# EAGLE design Robot (EAGLE 6.5.0)
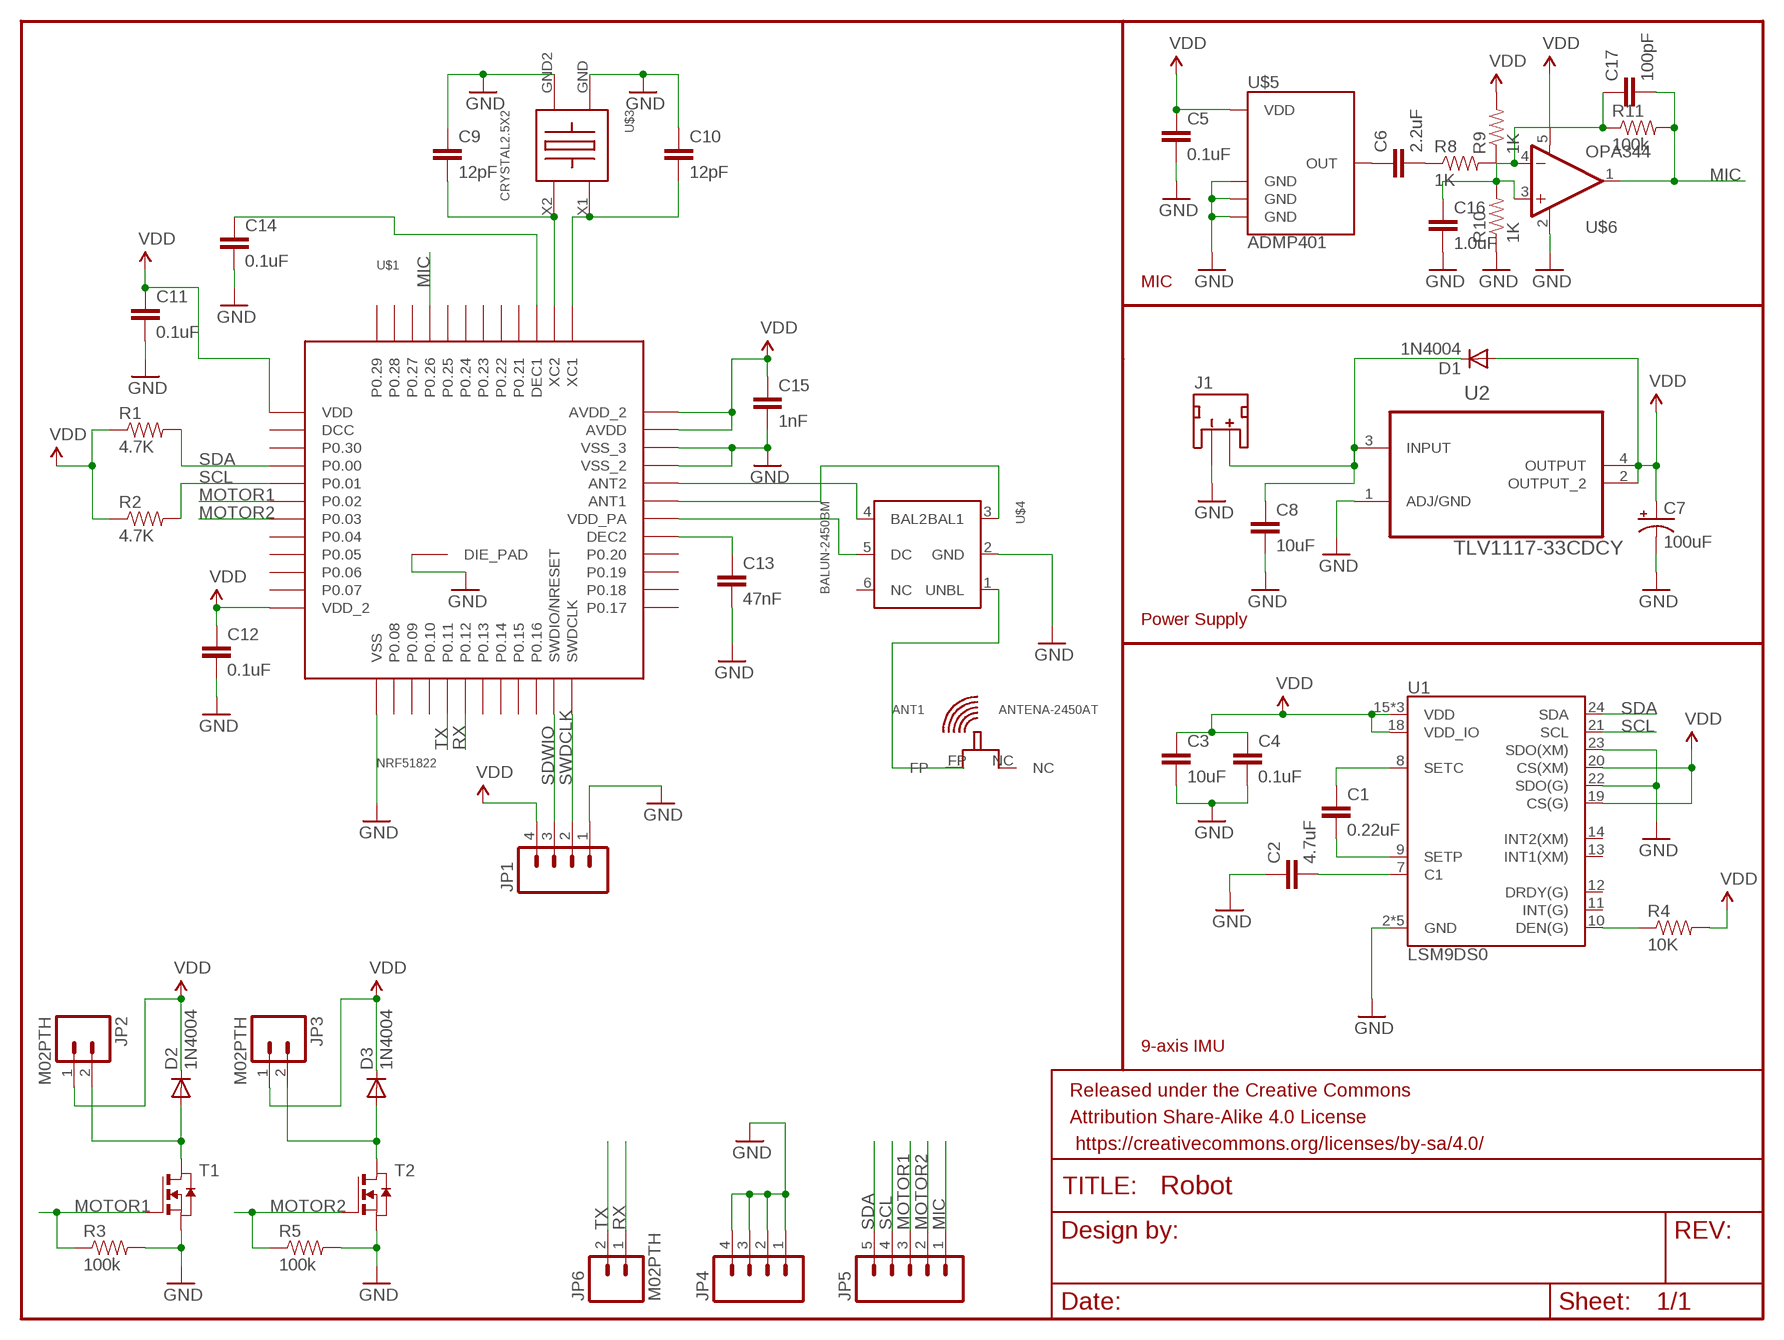
[diagram p0: schematic, sheet 1]

## Parts
ANT1  ANTENA-2450AT  [2450AT18B100]
C1  0.22uF  0.22UF-25V-10%(0603)  [0603-CAP]
C2  4.7uF  4.7UF-6.3V-10%(0603)0603  [0603-CAP]
C3  10uF  10UF-6.3V-20%(0603)  [0603-CAP]
C4  0.1uF  0.1UF-100V-10%(0603)  [0603-CAP]
C5  0.1uF  0.1UF-100V-10%(0603)  [0603-CAP]
C6  2.2uF  2.2UF-10V-20%(0603)  [0603-CAP]
C7  100uF  100UF-10V-10%(TANT)  [EIA7343]
C8  10uF  10UF-6.3V-20%(0603)  [0603-CAP]
C9  12pF  12PF-50V-5%(0603)  [0603-CAP]
C10  12pF  12PF-50V-5%(0603)  [0603-CAP]
C11  0.1uF  0.1UF-100V-10%(0603)  [0603-CAP]
C12  0.1uF  0.1UF-100V-10%(0603)  [0603-CAP]
C13  47nF  47NF(0.047UF/47000PF)-25V-5%(0603)SMD  [0603-CAP]
C14  0.1uF  0.1UF-100V-10%(0603)  [0603-CAP]
C15  1nF  1NF/1000PF-50V-10%(0603)  [0603-CAP]
C16  1.0uF  1.0UF-16V-10%(0603)  [0603-CAP]
C17  100pF  100PF-50V-5%(0603)  [0603-CAP]
D1  1N4004  [DO41-10]
D2  1N4004  [DO41-10]
D3  1N4004  [DO41-10]
FRAME1  FRAME-LETTER  [CREATIVE_COMMONS]
J1  JST_2MM_MALE  [JST-2-SMD]
JP1  M04PTH  [1X04]
JP2  M02PTH  [1X02]
JP3  M02PTH  [1X02]
JP4  M04PTH  [1X04]
JP5  M05PTH  [1X05]
JP6  M02PTH  [1X02]
R1  4.7K  4.7KOHM-1/10W-1%(0603)  [0603-RES]
R2  4.7K  4.7KOHM-1/10W-1%(0603)  [0603-RES]
R3  100k  100KOHM-1/10W-1%(0603)  [0603-RES]
R4  10K  10KOHM-1/10W-1%(0603)0603  [0603-RES]
R5  100k  100KOHM-1/10W-1%(0603)  [0603-RES]
R8  1K  1KOHM-1/10W-1%(0603)  [0603-RES]
R9  1K  1KOHM-1/10W-1%(0603)  [0603-RES]
R10  1K  1KOHM-1/10W-1%(0603)  [0603-RES]
R11  100k  100KOHM-1/10W-1%(0603)  [0603-RES]
T1  NMOSSOT23  [SOT-23]
T2  NMOSSOT23  [SOT-23]
U1  LSM9DS0  [LGA-24]
U2  TLV1117-33CDCY  [SOT230P700X180-4N]
U$1  NRF51822  [QFN48]
U$3  CRYSTAL2.5X2  [2.5X2MM]
U$4  BALUN-2450BM  [2450BM14A0002]
U$5  ADMP401  [ADMP401]
U$6  OPA344  [SOT23-5]

## Nets
GND: C2.1 C3.2 C4.2 C5.2 C7.C(-) C8.2 C9.1 C10.1 C11.2 C12.2 C13.2 C14.2 C15.2 C16.2 J1.1(-) JP1.1 JP4.1 JP4.2 JP4.3 JP4.4 R3.2 R5.2 R10.1 T1.2(S) T2.2(S) U1.2(GND) U1.3(GND) U1.4(GND) U1.5(GND) U1.6(GND) U1.22(SDO(G)) U1.23(SDO(XM)) U2.1(ADJ/GND) U$1.13(VSS) U$1.33(VSS_2) U$1.34(VSS_3) U$1.GND(DIE_PAD) U$3.GND U$3.GND2 U$4.2(GND) U$5.2(GND) U$5.4(GND) U$5.6(GND) U$6.2(V-)
MIC: C17.2 JP5.1 R11.2 U$1.45(P0.26) U$6.1(OUT)
MOTOR1: JP5.3 R3.1 T1.3(G) U$1.6(P0.02)
MOTOR2: JP5.2 R5.1 T2.3(G) U$1.7(P0.03)
N$1: C1.1 U1.8(SETC)
N$2: C1.2 U1.9(SETP)
N$3: C2.2 U1.7(C1)
N$4: R4.1 U1.10(DEN(G))
N$5: C8.1 D1.C J1.2(+) U2.3(INPUT)
N$6: C6.1 U$5.1(OUT)
N$7: C13.1 U$1.29(DEC2)
N$8: C9.2 U$1.38(XC2) U$3.X2
N$9: C10.2 U$1.37(XC1) U$3.X1
N$10: C14.1 U$1.39(DEC1)
N$11: U$1.32(ANT2) U$4.4(BAL2)
N$12: U$1.31(ANT1) U$4.3(BAL1)
N$13: U$1.30(VDD_PA) U$4.5(DC)
N$14: ANT1.FP U$4.1(UNBL)
N$15: D2.A JP2.2 T1.1(D)
N$16: D3.A JP3.2 T2.1(D)
N$19: C6.2 R8.1
N$20: C16.1 R9.1 R10.2 U$6.3(+IN)
N$22: C17.1 R8.2 R11.1 U$6.4(-IN)
RX: JP6.1 U$1.18(P0.12)
SCL: JP5.4 R2.2 U1.21(SCL) U$1.5(P0.01)
SDA: JP5.5 R1.2 U1.24(SDA) U$1.4(P0.00)
SDWIO: JP1.3 U$1.23(SWDIO/NRESET)
SWDCLK: JP1.2 U$1.24(SWDCLK)
TX: JP6.2 U$1.17(P0.11)
VDD: C3.1 C4.1 C5.1 C7.A(+) C11.1 C12.1 C15.1 D1.A D2.C D3.C JP1.4 JP2.1 JP3.1 R1.1 R2.1 R4.2 R9.2 U1.15(VDD) U1.16(VDD) U1.17(VDD) U1.18(VDD_IO) U1.19(CS(G)) U1.20(CS(XM)) U2.2(OUTPUT_2) U2.4(OUTPUT) U$1.1(VDD) U$1.12(VDD_2) U$1.35(AVDD) U$1.36(AVDD_2) U$5.5(VDD) U$6.5(V+)
Unconnected: ANT1.NC J1.NC1(PAD1) J1.NC2(PAD2) U1.11(INT(G)) U1.12(DRDY(G)) U1.13(INT1(XM)) U1.14(INT2(XM)) U$1.2(DCC) U$1.3(P0.30) U$1.8(P0.04) U$1.9(P0.05) U$1.10(P0.06) U$1.11(P0.07) U$1.14(P0.08) U$1.15(P0.09) U$1.16(P0.10) U$1.19(P0.13) U$1.20(P0.14) U$1.21(P0.15) U$1.22(P0.16) U$1.25(P0.17) U$1.26(P0.18) U$1.27(P0.19) U$1.28(P0.20) U$1.40(P0.21) U$1.41(P0.22) U$1.42(P0.23) U$1.43(P0.24) U$1.44(P0.25) U$1.46(P0.27) U$1.47(P0.28) U$1.48(P0.29) U$4.6(NC)

## Notes on the sheet
- MIC
- Power Supply
- 9-axis IMU

## Library data of the parts
ANT1 = NordicSemi:ANTENA-2450AT: General Specifications: Part Number 2450AT18B100 Input Power 3W max. Frequency Range 2400 - 2500 Mhz Impedance 50 Ω Peak Gain 0.5 dBi typ. (XZ-V) Operating Temperature -40 to +85°C Average Gain -0.5 dBi typ. (XZ-V) Reel Quanity 3,000 Return Loss 9.5 dB min
C1 = SparkFun-Capacitors:0.22UF-25V-10%(0603): CAP-07822; PROD_ID: CAP-07822
C2 = SparkFun-Capacitors:4.7UF-6.3V-10%(0603): CAP-08280; PROD_ID: CAP-08280
C3 C8 = SparkFun-Capacitors:10UF-6.3V-20%(0603): CAP-11015; PROD_ID: CAP-11015
C4 C5 C11 C12 C14 = SparkFun-Capacitors:0.1UF-100V-10%(0603): CAP-08390; PROD_ID: CAP-08390
C6 = SparkFun-Capacitors:2.2UF-10V-20%(0603): CAP-07888; PROD_ID: CAP-07888
C7 = SparkFun-Capacitors:100UF-10V-10%(TANT): CAP-07890; PROD_ID: CAP-07890
C9 C10 = SparkFun-Capacitors:12PF-50V-5%(0603): CAP-09137; PROD_ID: CAP-09137
C13 = SparkFun-Capacitors:47NF(0.047UF/47000PF)-25V-5%(0603): CAP-08605; PROD_ID: CAP-08605
C15 = SparkFun-Capacitors:1NF/1000PF-50V-10%(0603): CAP-07886; PROD_ID: CAP-07886
C16 = SparkFun-Capacitors:1.0UF-16V-10%(0603): CAP-00868; PROD_ID: CAP-00868
C17 = SparkFun-Capacitors:100PF-50V-5%(0603): CAP-07883; PROD_ID: CAP-07883
D1-D3 = diode:1N4004: DIODE general purpose rectifier, 1 A
FRAME1 = SparkFun-Aesthetics:FRAME-LETTER: Schematic Frame Standard 8.5x11 US Letter frame
J1 = SparkFun-Connectors:JST_2MM_MALE: Mates to single-cell LiPo batteries. CONN-08352; PROD_ID: CONN-08352
JP1 JP4 = SparkFun-Connectors:M04: Header 4 Standard 4-pin 0.1" header. Use with straight break away headers (SKU : PRT-00116), right angle break away headers (PRT-00553), swiss pins (PRT-00743), machine pins (PRT-00117), and female headers (PRT-00115). Molex polarized connector foot print use with SKU : PRT-08231 with associated crimp pins and housings. 1MM SMD Version SKU: PRT-10208
JP2 JP3 JP6 = SparkFun-Connectors:M02: Standard 2-pin 0.1" header. Use with - straight break away headers ( PRT-00116) - right angle break away headers (PRT-00553) - swiss pins (PRT-00743) - machine pins (PRT-00117) - female headers (PRT-00115) Molex polarized connector foot print use with: PRT-08233 with associated crimp pins and housings. 2.54_SCREWTERM for use with PRT-10571. 3.5mm Screw Terminal footprints for PRT-08084 5mm Screw Terminal footprints for use with PRT-08432
JP5 = SparkFun-Connectors:M05: Header 5 Standard 5-pin 0.1" header. Use with straight break away headers (SKU : PRT-00116), right angle break away headers (PRT-00553), swiss pins (PRT-00743), machine pins (PRT-00117), and female headers (PRT-00115). Molex polarized connector foot print use with SKU : PRT-08230 with associated crimp pins and housings.
R1 R2 = SparkFun-Resistors:4.7KOHM-1/10W-1%(0603): RES-07857; PROD_ID: RES-07857
R3 R5 R11 = SparkFun-Resistors:100KOHM-1/10W-1%(0603): RES-07828; PROD_ID: RES-07828
R4 = SparkFun-Resistors:10KOHM-1/10W-1%(0603): RES-00824; PROD_ID: RES-00824
R8-R10 = SparkFun-Resistors:1KOHM-1/10W-1%(0603): RES-07856; PROD_ID: RES-07856
T1 T2 = zetex:NMOSSOT23: MOS FET; OC_FARNELL: unknown; OC_NEWARK: unknown
U1 = SparkFun-DigitalIC:LSM9DS0: LSM9DS0 3D Accelerometer, 3D Gyroscope, 3D Magnetomter Features: 3 acceleration channels, 3 angular rate channels, 3 magnetic field channels ±2/±4/±6/±8/±16 g linear acceleration full scale ±2/±4/±8/±12 gauss magnetic full scale ±245/±500/±2000 dps angular rate full scale 16-bit data output SPI / I2C serial interfaces Analog supply voltage 2.4 V to 3.6 V Power-down mode / low-power mode Programmable interrupt generators Embedded self-test Embedded temperature sensor Embedded FIFO Position and motion detection functions Click/double-click recognition
U2 = Texas Instruments_By_element14_Batch_1:TLV1117-33CDCY: V REG, LDO, 3.3V, 0.8A; MPN: TLV1117-33CDCY; OC_FARNELL: 1494942; OC_NEWARK: 67K8520; PACKAGE: SOT-223-3; SUPPLIER: TEXAS INSTRUMENTS
U$1 = NordicSemi:NRF51822: Bluetooth 4.0 Low Energy/2.4Ghz NORDIC SEMICONDUCTOR
U$3 = NordicSemi:CRYSTAL2.5X2: Crystal 16.00MHz 8pF SMD Size Dimension: 2.5mm x 2.00mm Package: 4-SMD
U$4 = NordicSemi:BALUN-2450BM: General Specifications: Part Number 2450BM14A0002 Insertion Loss 2.0 dB max. Frequency (MHz) 2400 - 2500 Return Loss 9.5 dB min. Unbalanced Impedance 50 Ω Phase Difference 160° ± 15° Amplitude Difference 3.5 ± 1.5 dB Reel Quanity 4,000 Operating Temperature -40 to +85°C Attenuation: Common Mode 2.45 GHz Impedance Matched Balun-Filter: Optimized for Nordic's Chipset nRF24L01/+ Differential Balanced Impedance Conjugate match to Nordic nRF24L01/nRF24L01+ Attenuation: Differential Mode 15 min.@4800~5000MHz 15 min.@7200~7500MHz
U$5 = SparkFun-Sensors:ADMP401: Omnidirection bottom-port MEMS microphone
U$6 = SparkFun-AnalogIC:OPA344: Single gate rail-to-rail output op-amp. Inputs extend 300mV past rails.

## Board
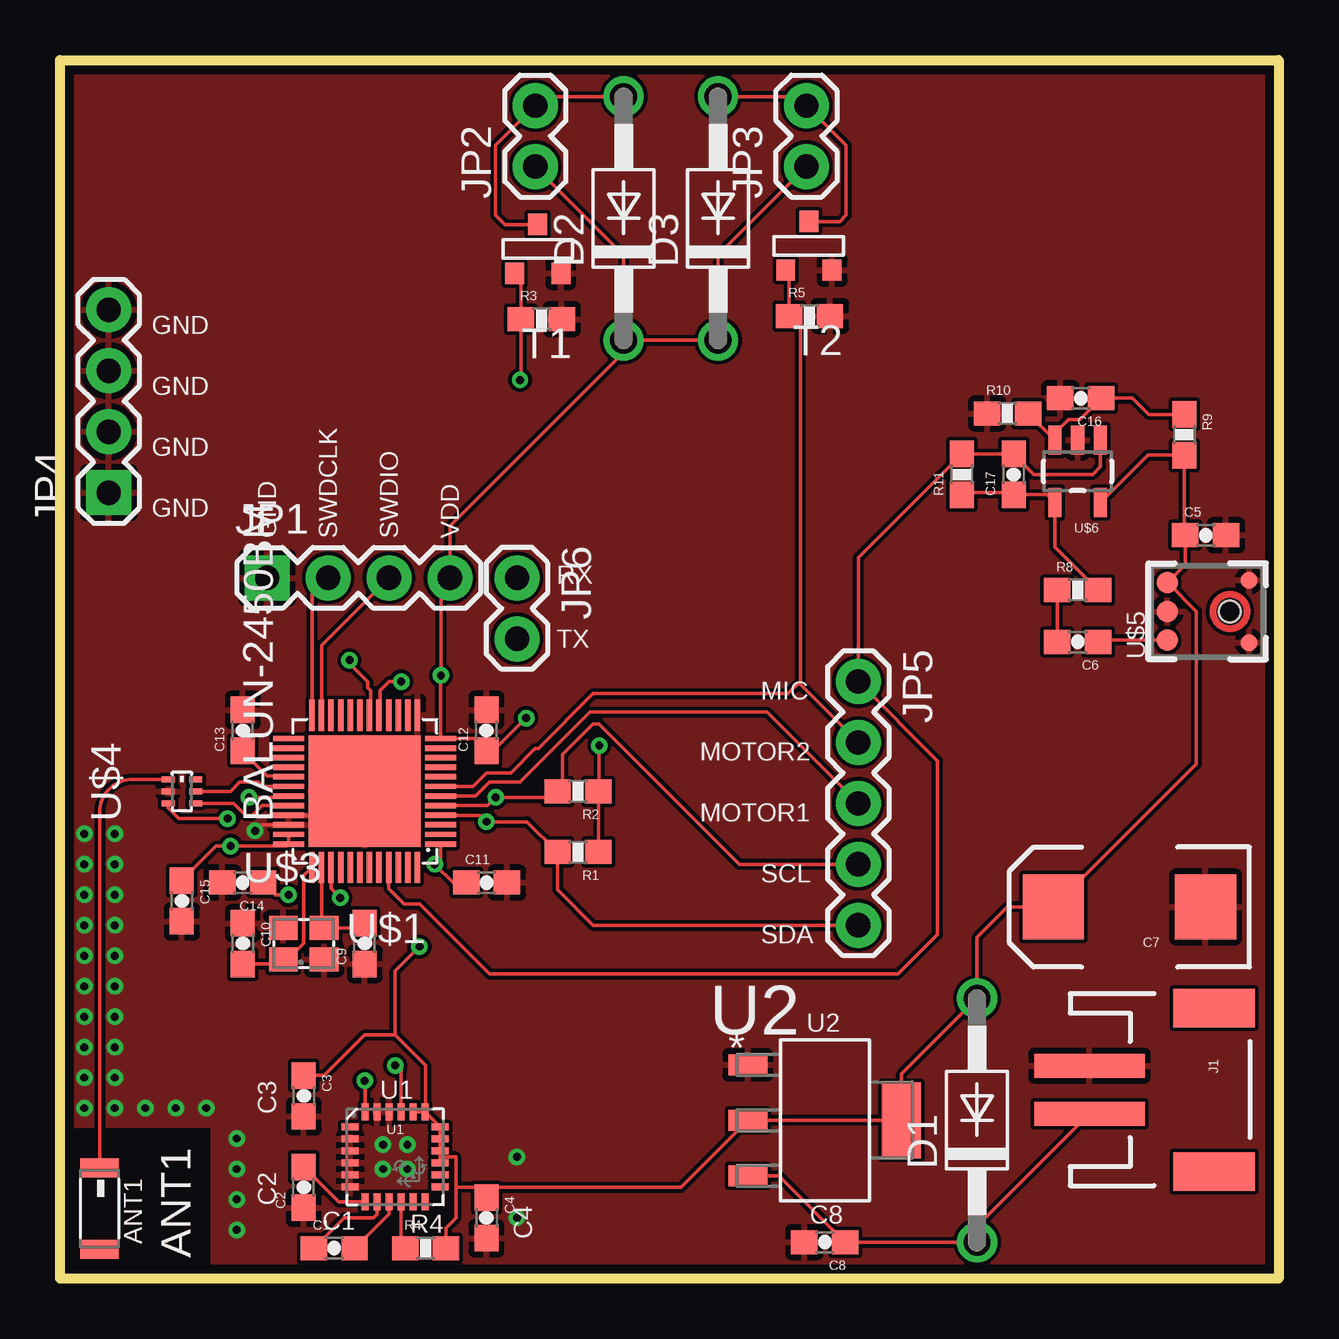
[diagram p1: board, top side]
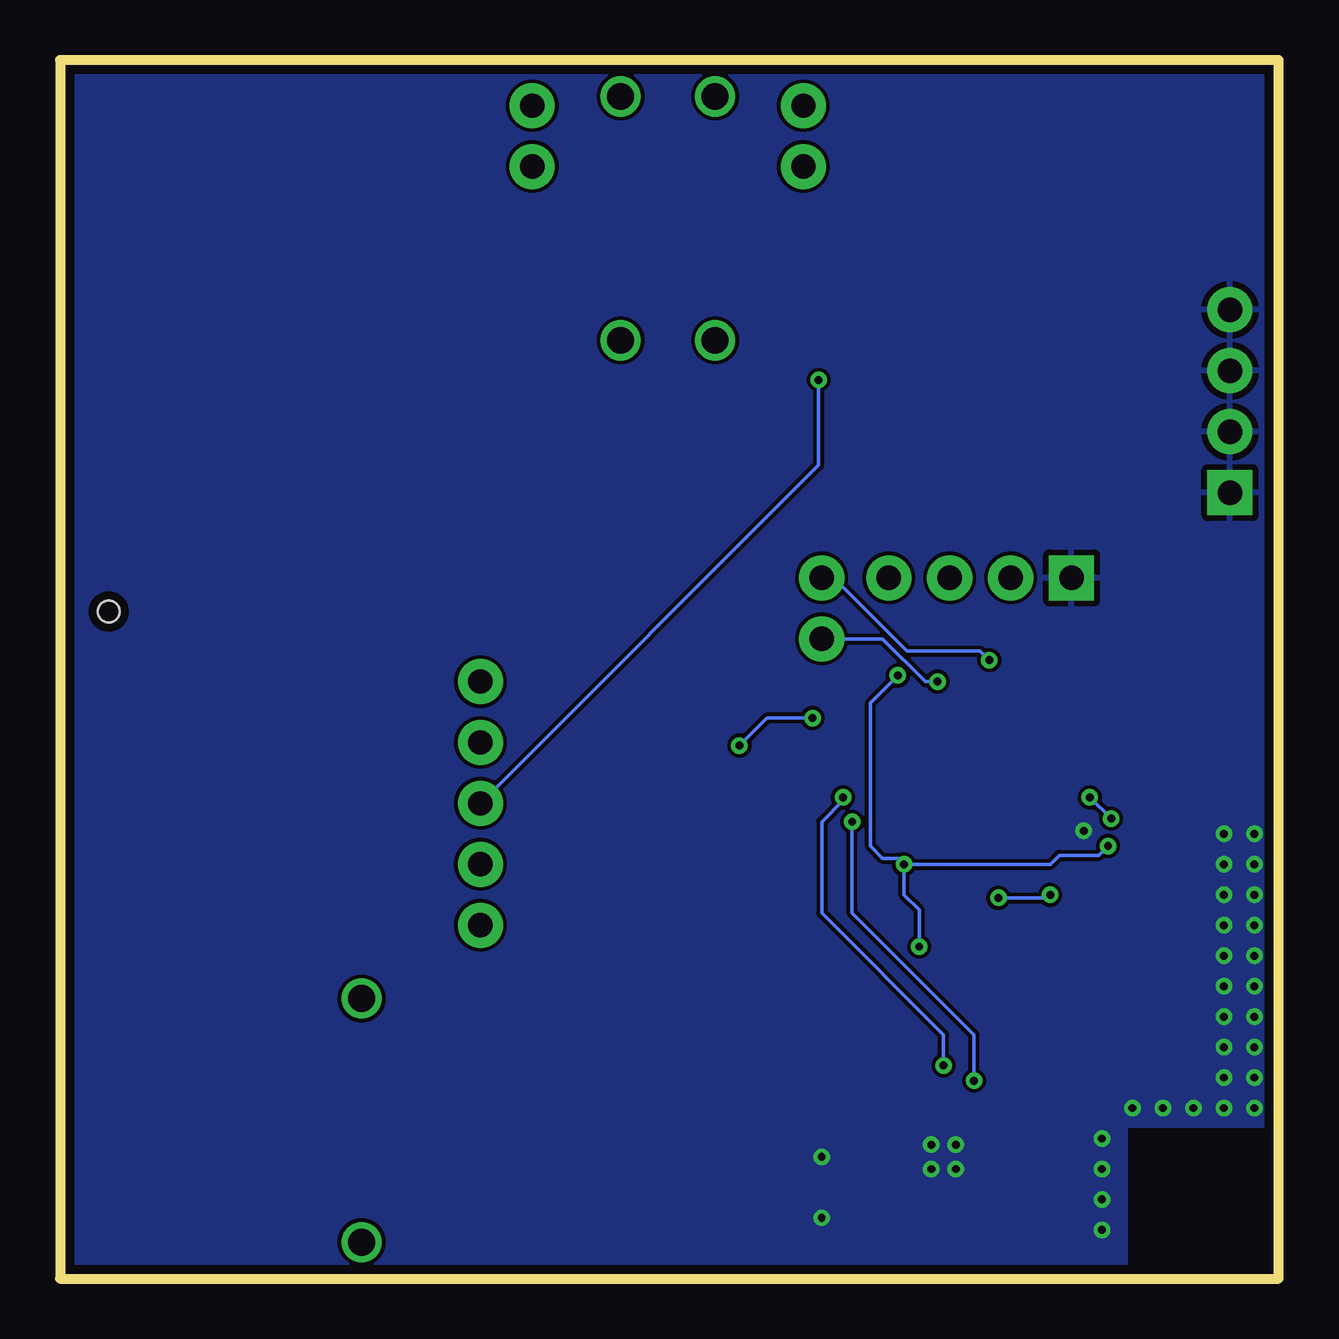
[diagram p2: board, bottom side, seen from below]

Size 50.8 x 50.8 mm. Coordinates in mm from the lower left corner, seen from the top.
Outline: 0,0 0,50.8 50.8,50.8 50.8,0 0,0
Copper layers (1*16): Top 0.0356mm / dielectric 1.5011mm / Bottom 0.0356mm
Design rules "OshPark": minimum track width 6mil, minimum drill 13mil, track to track 6mil, track to pad 6mil, pad to pad 6mil, via to via 6mil, smd to smd 6mil, copper to edge 15mil, drill to drill 6mil, minimum pad ring 7mil, minimum via ring 7mil, stop-mask expansion 3mil, vias tented up to drill 0mil, thermal gap 10mil

### Footprints (pad centres in the part's own frame; a part is rotated, then mirrored left to right if it is on the bottom)
2450AT18B100 = smd 0.8 x 1.6: FP -1.7,0; NC 1.7,0
0603-CAP = smd 1.1 x 1: 1 -0.85,0; 2 0.85,0
EIA7343 = smd 2.55 x 2.7: A 3.17,0; C -3.17,0
DO41-10 = drill 1.118: A 5.08,0; C -5.08,0
JST-2-SMD = smd 1 x 4.6: 1 -1,-3.7; 2 1,-3.7 | smd 1.6 x 3.4: NC1 -3.4,1.5; NC2 3.4,1.5
1X04 = drill 1.016 pad 1.88 square: 1 0,0 | drill 1.016 pad 1.88: 2 2.54,0; 3 5.08,0; 4 7.62,0
1X02 = drill 1.016 pad 1.88: 1 0,0; 2 2.54,0
1X05 = drill 1.016 pad 1.88: 1 0,0; 2 2.54,0; 3 5.08,0; 4 7.62,0; 5 10.16,0
0603-RES = smd 1.1 x 1: 1 -0.85,0; 2 0.85,0
SOT-23 = smd 0.787 x 0.889: 1 0.025,-1.016; 2 -0.94,1.016; 3 0.991,1.016
LGA-24 = smd 0.7 x 0.29: 1 -1.875,1.25; 2 -1.875,0.75; 3 -1.875,0.25; 4 -1.875,-0.25; 5 -1.875,-0.75; 6 -1.875,-1.25; 13 1.875,-1.25; 14 1.875,-0.75; 15 1.875,-0.25; 16 1.875,0.25; 17 1.875,0.75; 18 1.875,1.25 | smd 0.29 x 0.7: 7 -1.25,-1.875; 8 -0.75,-1.875; 9 -0.25,-1.875; 10 0.25,-1.875; 11 0.75,-1.875; 12 1.25,-1.875; 19 1.25,1.875; 20 0.75,1.875; 21 0.25,1.875; 22 -0.25,1.875; 23 -0.75,1.875; 24 -1.25,1.875
SOT230P700X180-4N = smd 1.626 x 0.889: 1 -3.2,2.311; 2 -3.2,0; 3 -3.2,-2.311 | smd 1.626 x 3.175: 4 3.2,0
QFN48 = smd 1.3 x 0.226: 1 -3.17,2.2; 2 -3.17,1.8; 3 -3.17,1.4; 4 -3.17,1; 5 -3.17,0.6; 6 -3.17,0.2; 7 -3.17,-0.2; 8 -3.17,-0.6; 9 -3.17,-1; 10 -3.17,-1.4; 11 -3.17,-1.8; 12 -3.17,-2.2; 25 3.17,-2.2; 26 3.17,-1.8; 27 3.17,-1.4; 28 3.17,-1; 29 3.17,-0.6; 30 3.17,-0.2; 31 3.17,0.2; 32 3.17,0.6; 33 3.17,1; 34 3.17,1.4; 35 3.17,1.8; 36 3.17,2.2 | smd 0.226 x 1.3: 13 -2.2,-3.17; 14 -1.8,-3.17; 15 -1.4,-3.17; 16 -1,-3.17; 17 -0.6,-3.17; 18 -0.2,-3.17; 19 0.2,-3.17; 20 0.6,-3.17; 21 1,-3.17; 22 1.4,-3.17; 23 1.8,-3.17; 24 2.2,-3.17; 37 2.2,3.17; 38 1.8,3.17; 39 1.4,3.17; 40 1,3.17; 41 0.6,3.17; 42 0.2,3.17; 43 -0.2,3.17; 44 -0.6,3.17; 45 -1,3.17; 46 -1.4,3.17; 47 -1.8,3.17; 48 -2.2,3.17 | smd 4.66 x 4.66: GND 0,0
2.5X2MM = smd 1.2 x 1: GND 0.85,-0.65; GND2 -0.85,0.65; X1 -0.85,-0.65; X2 0.85,0.65
2450BM14A0002 = smd 0.25 x 0.55: 1 0.5,0.575; 2 0,0.575; 3 -0.5,0.575; 4 -0.5,-0.575; 5 0,-0.575; 6 0.5,-0.575
ADMP401 = smd 0.9 x 0.9: 1 -1.2,2.62; 5 1.2,2.62; 6 0,2.62 | smd 0.7 x 0.7: 2 1.3,-0.8; 4 -1.3,-0.8 | hole 0.9: 0,0
SOT23-5 = smd 0.55 x 1.2: 1 -0.95,-1.3; 2 0,-1.3; 3 0.95,-1.3; 4 0.95,1.3; 5 -0.95,1.3

### Placement (x,y rotation side)
ANT1  1.65,2.92 270 top
C1  11.43,1.27 0 top
C2  10.16,3.81 90 top
C3  10.16,7.62 270 top
C4  17.78,2.54 270 top
C5  47.75,30.99 0 top
C6  42.42,26.54 180 top
C7  44.58,15.49 180 top
C8  31.88,1.52 180 top
C9  12.7,13.97 90 top
C10  7.62,13.97 270 top
C11  17.78,16.51 0 top
C12  17.78,22.86 90 top
C13  7.62,22.86 90 top
C14  7.62,16.51 180 top
C15  5.08,15.75 270 top
C16  42.55,36.7 180 top
C17  39.75,33.53 90 top
D1  38.23,6.6 90 top
D2  23.5,44.2 90 top
D3  27.43,44.2 90 top
FRAME1  -77.47,25.4 0 top  (outside the outline)
J1  46.61,7.87 270 top
JP1  8.64,29.21 0 top
JP2  19.81,46.35 90 top
JP3  31.11,46.35 90 top
JP4  2.03,32.77 90 top
JP5  33.27,24.89 270 top
JP6  19.05,29.21 270 top
R1  21.59,17.78 180 top
R2  21.59,20.32 180 top
R3  20.07,40.01 0 top
R4  15.24,1.27 0 top
R5  31.24,40.13 0 top
R8  42.42,28.7 0 top
R9  46.86,35.18 270 top
R10  39.5,36.07 0 top
R11  37.59,33.53 90 top
T1  19.94,42.93 180 top
T2  31.24,43.05 180 top
U1  13.97,5.08 0 top
U2  31.88,6.6 0 top
U$1  12.7,20.32 180 top
U$3  10.16,13.97 0 top
U$4  5.08,20.32 90 top
U$5  48.77,27.81 90 top
U$6  42.42,33.66 180 top

### Tracks (layer width: path | path; a pad name or v marks a point on that pad's centre or on a via)
GND  (via drill 0.33)
  Top 0.152: U$1.34 8.38,18.92 v8.13,18.67 | 12.7,20.07 U$1.GND 12.7,19.68 12.32,19.3 9.55,19.3 U$1.33
  other vias: 19.05,2.54 19.05,5.08 13.46,4.57 13.46,5.59 14.48,5.59 14.48,4.57 1.02,7.11 2.29,7.11 3.56,7.11 4.83,7.11 6.1,7.11 7.37,5.84 7.37,4.57 7.37,3.3 7.37,2.03 2.29,8.38 1.02,8.38 1.02,9.65 1.02,10.92 1.02,12.19 1.02,13.46 1.02,14.73 1.02,16 1.02,17.27 1.02,18.54 2.29,9.65 2.29,10.92 2.29,12.19 2.29,13.46 2.29,14.73 2.29,16 2.29,17.27 2.29,18.54
  pour Top: 0,6.35 0,50.8 50.8,50.8 50.8,0 6.35,0 6.35,6.35
  pour Bottom: 0,6.35 0,50.8 50.8,50.8 50.8,0 6.35,0 6.35,6.35
MIC
  Top 0.152: U$6.1 43.37,33.84 43.05,33.53 40.6,33.53 C17.2 R11.2 33.27,30.06 JP5.1 36.58,21.59 36.58,14.35 34.92,12.7 17.91,12.7 14.99,15.62 14.35,15.62 13.7,16.27 U$1.45
MOTOR1  (via drill 0.33)
  Top 0.152: T1.3 19.22,41.64 R3.1 19.22,37.5 v19.18,37.47 | U$1.6 17.33,20.12 17.91,20.7 19.18,20.7 22.1,23.62 29.46,23.62 JP5.3
  Bottom 0.152: v19.18,37.47 19.18,33.91 JP5.3
MOTOR2
  Top 0.152: T2.3 30.39,41.9 R5.1 30.86,39.66 30.86,24.89 | JP5.2 30.86,24.77 30.86,24.89 | U$1.7 17.22,20.52 17.78,21.08 18.8,21.08 19.81,22.1 19.94,22.1 22.23,24.38 30.35,24.38 30.86,24.89
N$1
  Top 0.152: C1.1 11.85,2.54 12.57,2.54 12.7,2.54 13.08,2.54 13.22,2.68 U1.8
N$2
  Top 0.152: C1.2 13.72,2.71 U1.9
N$3
  Top 0.152: C2.2 11.62,3.21 U1.7
N$4
  Top 0.152: U1.10 14.22,1.44 14.39,1.44 R4.1
N$5
  Top 0.152: U2.3 29.96,4.29 C8.1 D1.C 38.23,2.19 J1.2
N$6
  Top 0.152: U$5.1 43.34,26.61 C6.1
N$7
  Top 0.152: C13.1 7.62,21.97 8.64,20.95 9.49,20.95 U$1.29
N$8
  Top 0.152: C9.2 12.5,14.62 U$3.X2 10.9,14.73 U$1.38
N$9
  Top 0.152: C10.2 9.11,13.12 U$3.X1 9.51,13.32 10.16,13.97 10.16,16.81 U$1.37
N$10  (via drill 0.33)
  Top 0.152: U$1.39 11.3,16.26 v11.68,15.88 | v9.53,16 8.98,16 C14.1
  Bottom 0.152: v11.68,15.88 9.65,15.88 v9.53,16
N$11
  Top 0.152: U$1.32 8.42,19.72 8,19.3 7.75,19.3 7.24,19.81 U$4.4
N$12  (via drill 0.33)
  Top 0.152: U$4.3 4.5,19.62 4.95,19.18 v6.99,19.18 | v7.87,20.07 9.48,20.07 U$1.31
  Bottom 0.152: v6.99,19.18 v7.87,20.07
N$13
  Top 0.152: U$1.30 8.44,20.52 8.26,20.7 7.49,20.7 7.11,20.32 U$4.5
N$14
  Top 0.152: U$4.1 3.04,20.82 arc90 1.65,19.43 ANT1.FP
N$15
  Top 0.152: D2.A 20.19,49.28 JP2.2 18.16,47.24 18.16,44.32 18.54,43.94 T1.1
N$16
  Top 0.152: D3.A 30.73,49.28 JP3.2 32.77,47.24 32.77,44.32 32.51,44.07 T2.1
N$19
  Top 0.152: C6.2 R8.1
N$20
  Top 0.152: R9.1 45.38,36.03 44.7,36.7 C16.1 42.51,35.81 42.04,35.81 41.47,35.24 U$6.3 R10.2
N$22
  Top 0.152: R8.2 41.47,30.5 U$6.4 41.15,32.68 C17.1 39.66,32.77 37.85,32.77 37.76,32.68 R11.1
RX  (via drill 0.33)
  Top 0.152: v12.06,25.78 12.06,25.65 12.83,24.89 12.83,24.64 12.95,24.51 12.95,23.54 U$1.18
  Bottom 0.152: JP6.1 18.54,29.21 15.49,26.16 12.45,26.16 v12.06,25.78
SCL  (via drill 0.33)
  Top 0.152: U1.21 14.22,8.64 v13.97,8.89 | U$1.5 17.82,19.72 v18.16,20.07 20.49,20.07 R2.2 20.95,20.54 20.95,21.84 22.23,23.11 22.48,23.11 28.32,17.27 JP5.4
  Bottom 0.152: v13.97,8.89 13.97,10.16 19.05,15.24 19.05,19.05 18.16,19.94 v18.16,20.07
SDA  (via drill 0.33)
  Top 0.152: U$1.4 17.51,19.32 v17.78,19.05 19.47,19.05 R1.2 20.74,16.22 22.23,14.73 JP5.5 | U1.24 12.72,8.23 v12.7,8.26
  Bottom 0.152: v12.7,8.26 12.7,10.16 17.78,15.24 v17.78,19.05
SDWIO
  Top 0.152: U$1.23 10.9,26.39 JP1.3
SWDCLK
  Top 0.152: U$1.24 10.5,28.53 JP1.2
TX  (via drill 0.33)
  Top 0.152: v14.22,24.89 13.72,24.89 13.34,24.51 13.34,23.52 U$1.17
  Bottom 0.152: JP6.2 16.51,26.67 14.73,24.89 v14.22,24.89
VDD  (via drill 0.33)
  Top 0.152: 16.51,3.81 16.51,2.54 16.09,2.12 R4.2 | 16.51,3.81 16.51,5.08 16.09,5.08 U1.15 U1.16 U1.17 U1.18 U1.19 | U1.19 U1.20 | 16.51,3.81 17.36,3.81 C4.1 18.2,3.81 25.88,3.81 U2.2 U2.4 35.08,8.53 D1.A 38.23,14.22 39.5,15.49 C7.A 47.37,21.46 47.37,27.81 46.17,29.01 U$5.5 46.9,29.77 C5.1 46.86,31.03 R9.2 45.34,34.33 U$6.5 | C3.1 11.01,8.47 12.7,10.16 13.97,10.16 | 13.97,10.16 15.24,8.89 15.24,6.97 U1.19 | U$1.35 U$1.36 9.44,18.03 v7.11,18.03 6.52,18.03 C15.1 | U$1.1 15.87,17.52 v15.62,17.27 16.38,16.51 C11.1 | 13.97,10.16 13.97,12.83 v14.99,13.84 | JP3.1 27.43,42.67 D3.C 24,39.12 | JP2.1 23.5,42.67 D2.C 24,39.12 | 15.87,28.82 JP1.4 | JP1.4 16.26,31.37 24,39.12 | JP1.4 15.88,28.83 v15.88,25.15 v15.87,25.14 U$1.12 17.27,22.52 C12.1 18.07,22.01 v19.43,23.37 | R1.1 R2.1 22.48,20.36 v22.48,22.23
  Bottom 0.152: v15.62,17.27 9.53,17.27 9.14,17.65 7.49,17.65 v7.11,18.03 | v15.62,17.27 15.88,17.53 16.51,17.53 17.02,18.03 17.02,24 v15.88,25.15 | v14.99,13.84 14.99,15.37 15.62,16 v15.62,17.27 | v19.43,23.37 21.34,23.37 v22.48,22.23

### Text on the board
_tsilk: GND | GND | GND | GND | GND | SWDCLK | SWDIO | VDD | RX | TX | MIC | MOTOR2 | MOTOR1 | SCL | SDA | U2 | C3 | U1 | ANT1 | C2 | C4 | C1 | R4 | C8